# EAGLE schematic supply (EAGLE 6.3)
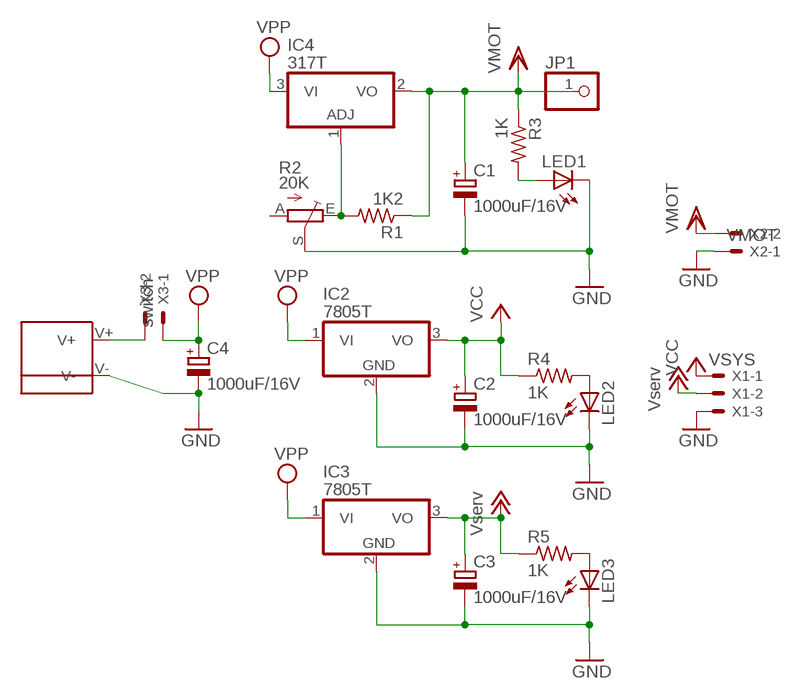
[diagram p0: schematic, sheet 1]

## Parts
C1  1000uF/16V  CPOL-EUE3.5-10  [E3,5-10]
C2  1000uF/16V  CPOL-EUE3.5-10  [E3,5-10]
C3  1000uF/16V  CPOL-EUE3.5-10  [E3,5-10]
C4  1000uF/16V  CPOL-EUE3.5-10  [E3,5-10]
IC2  7805T  [TO220H]
IC3  7805T  [TO220H]
IC4  317T  [TO220H]
JP1  PINHD-1X1  [1X01]
LED1  LED3MM  [LED3MM]
LED2  LED3MM  [LED3MM]
LED3  LED3MM  [LED3MM]
R1  1K2  R-US_0207/10  [0207/10]
R2  20K  TRIM_EU-CA6V  [CA6V]
R3  1K  R-US_0207/10  [0207/10]
R4  1K  R-US_0207/10  [0207/10]
R5  1K  R-US_0207/10  [0207/10]
VIN  CON-XT60M  [CON-XT60M]
X1  VSYS  22-23-2031  [22-23-2031]
X2  VMOT  22-23-2021  [22-23-2021]
X3  switch  22-23-2021  [22-23-2021]

## Nets
+12V: C3.+ IC3.3(VO) R5.1 X1.2 ; supply symbol labelled Vserv
GND: C1.- C2.- C3.- C4.- IC2.2(GND) IC3.2(GND) LED1.K(C) LED2.K(C) LED3.K(C) R2.S VIN.V- X1.3 X2.1
N$1: IC4.1(ADJ) R1.2 R2.E
N$2: LED1.A R3.2
N$3: LED3.A R5.2
N$4: VIN.V+ X3.2
N$5: LED2.A R4.2
VCC: C2.+ IC2.3(VO) R4.1 X1.1
VDD: C1.+ IC4.2(VO) JP1.1 R1.1 R3.1 X2.2 ; supply symbol labelled VMOT
VPP: C4.+ IC2.1(VI) IC3.1(VI) IC4.3(VI) X3.1
Unconnected: R2.A

## Library data of the parts
C1-C4 = rcl:CPOL-EU: POLARIZED CAPACITOR, European symbol
IC2 IC3 = linear:78*: Positive VOLTAGE REGULATOR Source: http://cache.national.com/ds/LM/LM78L05.pdf http://www.fairchildsemi.com/ds/LM/LM7805.pdf
IC4 = linear:*317: Positive VOLTAGE REGULATOR
JP1 = pinhead:PINHD-1X1: PIN HEADER
LED1-LED3 = led:LED: LED OSRAM: - CHIPLED LG R971, LG N971, LY N971, LG Q971, LY Q971, LO R971, LY R971 LH N974, LH R974 LS Q976, LO Q976, LY Q976 LO Q996 - Hyper CHIPLED LW Q18S LB Q993, LB Q99A, LB R99A - SideLED LS A670, LO A670, LY A670, LG A670, LP A670 LB A673, LV A673, LT A673, LW A673 LH A674 LY A675 LS A676, LA A676, LO A676, LY A676, LW A676 LS A679, LY A679, LG A679 - Hyper Micro SIDELED® LS Y876, LA Y876, LO Y876, LY Y876 LT Y87S - SmartLED LW L88C, LW L88S LB L89C, LB L89S, LG L890 LS L89K, LO L89K, LY L89K LS L896, LA L896, LO L896, LY L896 - TOPLED LS T670, LO T670, LY T670, LG T670, LP T670 LSG T670, LSP T670, LSY T670, LOP T670, LYG T670 LG T671, LOG T671, LSG T671 LB T673, LV T673, LT T673, LW T673 LH T674 LS T676, LA T676, LO T676, LY T676, LB T676, LH T676, LSB T676, LW T676 LB T67C, LV T67C, LT T67C, LS T67K, LO T67K, LY T67K, LW E67C LS E67B, LA E67B, LO E67B, LY E67B, LB E67C, LV E67C, LT E67C LW T67C LS T679, LY T679, LG T679 LS T770, LO T770, LY T770, LG T770, LP T770 LB T773, LV T773, LT T773, LW T773 LH T774 LS E675, LA E675, LY E675, LS T675 LS T776, LA T776, LO T776, LY T776, LB T776 LHGB T686 LT T68C, LB T68C - Hyper Mini TOPLED® LB M676 - Mini TOPLED Santana® LG M470 LS M47K, LO M47K, LY M47K Source: http://www.osram.convergy.de LUXEON: - LUMILED® LXK2-PW12-R00, LXK2-PW12-S00, LXK2-PW14-U00, LXK2-PW14-V00 LXK2-PM12-R00, LXK2-PM12-S00, LXK2-PM14-U00 LXK2-PE12-Q00, LXK2-PE12-R00, LXK2-PE12-S00, LXK2-PE14-T00, LXK2-PE14-U00 LXK2-PB12-K00, LXK2-PB12-L00, LXK2-PB12-M00, LXK2-PB14-N00, LXK2-PB14-P00, LXK2-PB14-Q00 LXK2-PR12-L00, LXK2-PR12-M00, LXK2-PR14-Q00, LXK2-PR14-R00 LXK2-PD12-Q00, LXK2-PD12-R00, LXK2-PD12-S00 LXK2-PH12-R00, LXK2-PH12-S00 LXK2-PL12-P00, LXK2-PL12-Q00, LXK2-PL12-R00 Source: www.luxeon.com KINGBRIGHT: KA-3528ASYC Source: www.kingbright.com
R1 R3-R5 = rcl:R-US_: RESISTOR, American symbol
R2 = pot:TRIM_EU-: POTENTIOMETER
VIN = con-XT60M:CON-XT60M
X1 = con-molex:22-23-2031: .100" (2.54mm) Center Header - 3 Pin; MF: MOLEX; MPN: 22-23-2031; OC_FARNELL: 1462950; OC_NEWARK: 30C0862
X2 X3 = con-molex:22-23-2021: .100" (2.54mm) Center Header - 2 Pin; MF: MOLEX; MPN: 22-23-2021; OC_FARNELL: 1462926; OC_NEWARK: 25C3832